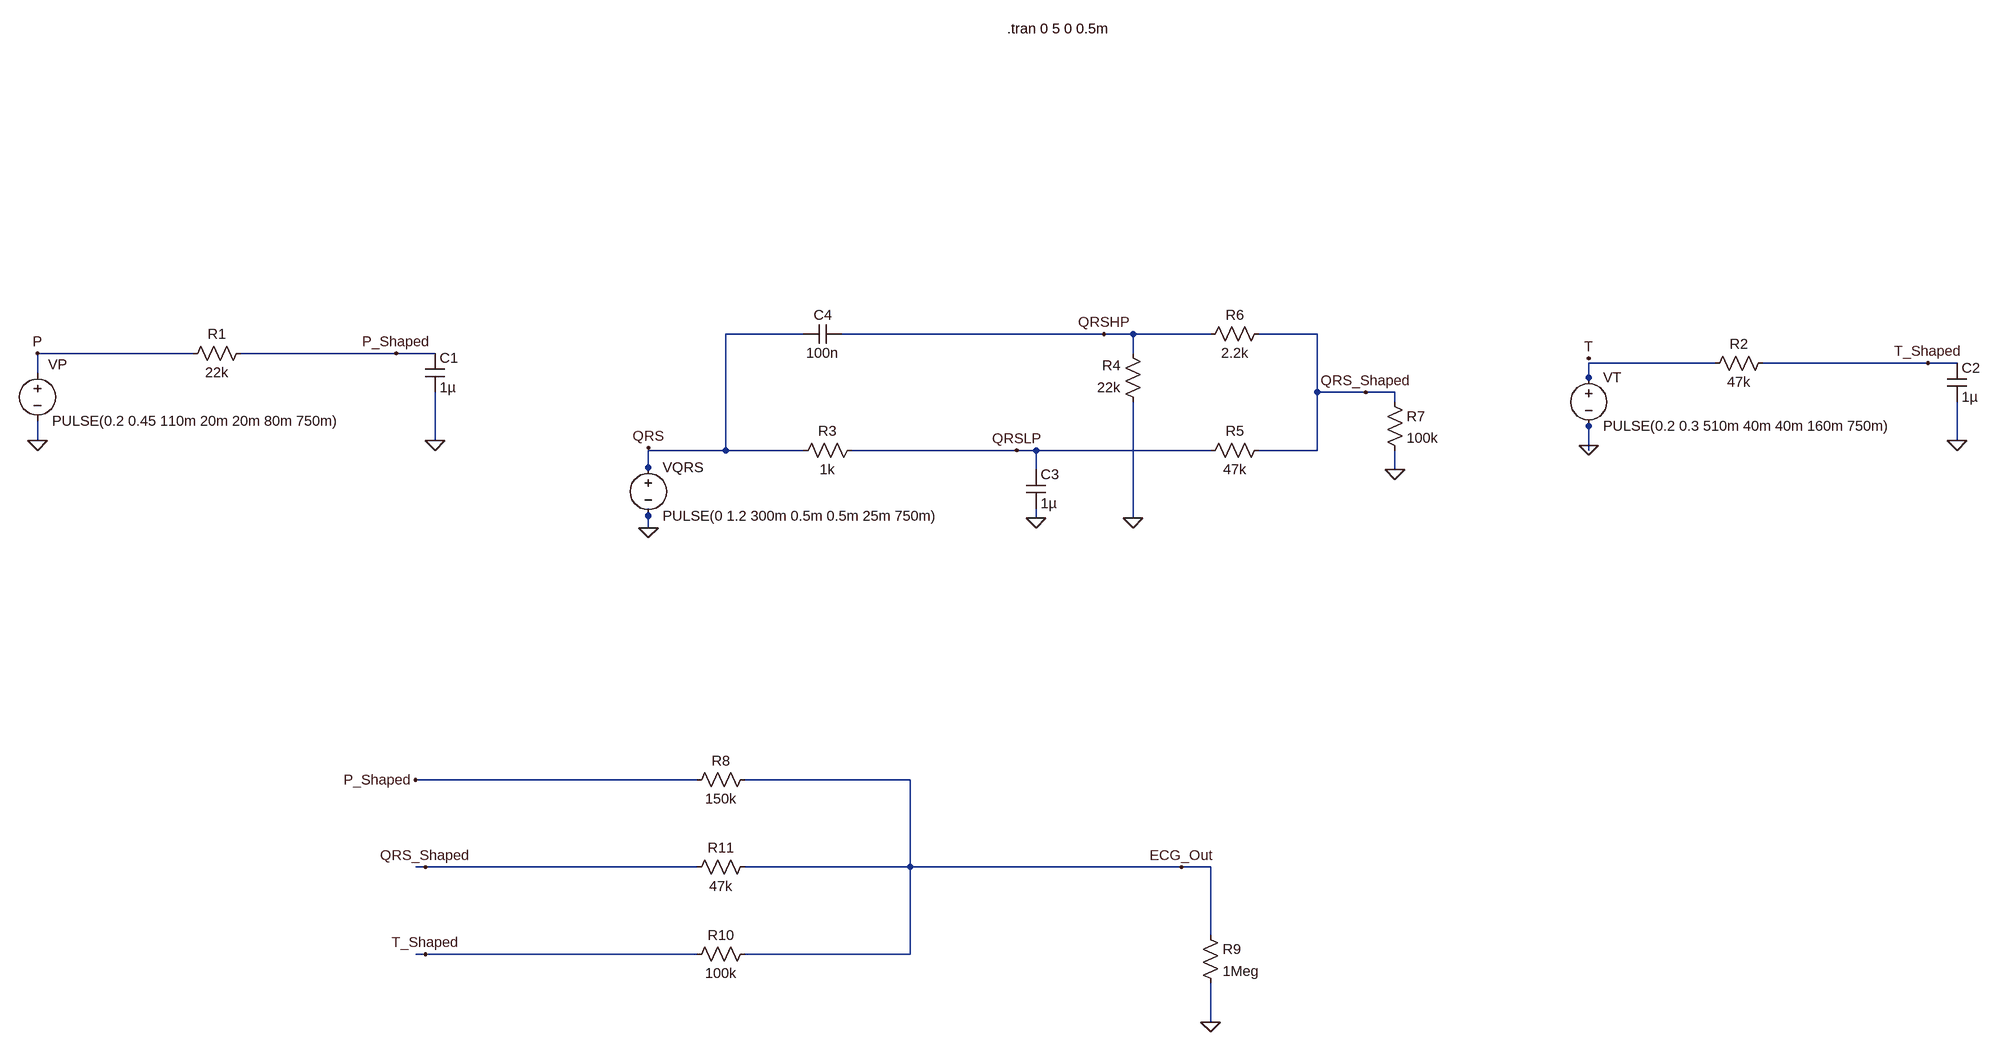
[diagram p0: schematic heartbeat.asc]
heartbeat.asc, the LTspice schematic file:
Version 4.1
SHEET 1 3464 788
WIRE 1376 -368 1248 -368
WIRE 1872 -368 1440 -368
WIRE 1920 -368 1872 -368
WIRE 2048 -368 1920 -368
WIRE 2224 -368 2128 -368
WIRE 368 -336 112 -336
WIRE 704 -336 448 -336
WIRE 768 -336 704 -336
WIRE 1920 -336 1920 -368
WIRE 2880 -320 2672 -320
WIRE 3232 -320 2960 -320
WIRE 3280 -320 3232 -320
WIRE 112 -304 112 -336
WIRE 2672 -296 2672 -320
WIRE 2672 -288 2672 -296
WIRE 2224 -272 2224 -368
WIRE 2304 -272 2224 -272
WIRE 2352 -272 2304 -272
WIRE 2352 -256 2352 -272
WIRE 2672 -216 2672 -224
WIRE 112 -192 112 -224
WIRE 768 -192 768 -272
WIRE 3280 -192 3280 -256
WIRE 2672 -184 2672 -216
WIRE 1248 -176 1248 -368
WIRE 1248 -176 1120 -176
WIRE 1376 -176 1248 -176
WIRE 1728 -176 1456 -176
WIRE 1760 -176 1728 -176
WIRE 2048 -176 1760 -176
WIRE 2224 -176 2224 -272
WIRE 2224 -176 2128 -176
WIRE 2672 -176 2672 -184
WIRE 1120 -148 1120 -176
WIRE 1120 -144 1120 -148
WIRE 1760 -144 1760 -176
WIRE 2352 -144 2352 -176
WIRE 1120 -68 1120 -80
WIRE 1760 -64 1760 -80
WIRE 1920 -64 1920 -256
WIRE 1120 -48 1120 -68
WIRE 1200 368 736 368
WIRE 1552 368 1280 368
WIRE 752 512 736 512
WIRE 1200 512 752 512
WIRE 1552 512 1552 368
WIRE 1552 512 1280 512
WIRE 2000 512 1552 512
WIRE 2048 512 2000 512
WIRE 2048 624 2048 512
WIRE 752 656 736 656
WIRE 1200 656 752 656
WIRE 1552 656 1552 512
WIRE 1552 656 1280 656
WIRE 2048 768 2048 704
FLAG 112 -336 P
FLAG 112 -192 0
FLAG 1120 -180 QRS
FLAG 2672 -328 T
FLAG 2672 -184 0
FLAG 1120 -48 0
FLAG 768 -192 0
FLAG 3280 -192 0
FLAG 1760 -64 0
FLAG 1920 -64 0
FLAG 1872 -368 QRSHP
FLAG 1728 -176 QRSLP
FLAG 2304 -272 QRS_Shaped
FLAG 2352 -144 0
FLAG 704 -336 P_Shaped
FLAG 3232 -320 T_Shaped
FLAG 736 368 P_Shaped
FLAG 752 512 QRS_Shaped
FLAG 752 656 T_Shaped
FLAG 2048 768 0
FLAG 2000 512 ECG_Out
SYMBOL voltage 112 -320 R0
WINDOW 0 18 2 Left 2
WINDOW 123 0 0 Left 0
WINDOW 39 0 0 Left 0
SYMATTR InstName VP
SYMATTR Value PULSE(0.2 0.45 110m 20m 20m 80m 750m)
SYMBOL voltage 1120 -164 R0
WINDOW 123 0 0 Left 0
WINDOW 39 0 0 Left 0
SYMATTR InstName VQRS
SYMATTR Value PULSE(0 1.2 300m 0.5m 0.5m 25m 750m)
SYMBOL voltage 2672 -312 R0
WINDOW 123 0 0 Left 0
WINDOW 39 0 0 Left 0
SYMATTR InstName VT
SYMATTR Value PULSE(0.2 0.3 510m 40m 40m 160m 750m)
SYMBOL res 464 -352 R90
WINDOW 0 0 56 VBottom 2
WINDOW 3 32 56 VTop 2
SYMATTR InstName R1
SYMATTR Value 22k
SYMBOL cap 752 -336 R0
SYMATTR InstName C1
SYMATTR Value 1µ
SYMBOL res 2976 -336 R90
WINDOW 0 0 56 VBottom 2
WINDOW 3 32 56 VTop 2
SYMATTR InstName R2
SYMATTR Value 47k
SYMBOL cap 3264 -320 R0
SYMATTR InstName C2
SYMATTR Value 1µ
SYMBOL res 1472 -192 R90
WINDOW 0 0 56 VBottom 2
WINDOW 3 32 56 VTop 2
SYMATTR InstName R3
SYMATTR Value 1k
SYMBOL cap 1744 -144 R0
SYMATTR InstName C3
SYMATTR Value 1µ
SYMBOL cap 1440 -384 R90
WINDOW 0 0 32 VBottom 2
WINDOW 3 32 32 VTop 2
SYMATTR InstName C4
SYMATTR Value 100n
SYMBOL res 1936 -240 R180
WINDOW 0 36 76 Left 2
WINDOW 3 36 40 Left 2
SYMATTR InstName R4
SYMATTR Value 22k
SYMBOL res 2144 -192 R90
WINDOW 0 0 56 VBottom 2
WINDOW 3 32 56 VTop 2
SYMATTR InstName R5
SYMATTR Value 47k
SYMBOL res 2144 -384 R90
WINDOW 0 0 56 VBottom 2
WINDOW 3 32 56 VTop 2
SYMATTR InstName R6
SYMATTR Value 2.2k
SYMBOL res 2336 -272 R0
SYMATTR InstName R7
SYMATTR Value 100k
SYMBOL res 1296 352 R90
WINDOW 0 0 56 VBottom 2
WINDOW 3 32 56 VTop 2
SYMATTR InstName R8
SYMATTR Value 150k
SYMBOL res 1296 640 R90
WINDOW 0 0 56 VBottom 2
WINDOW 3 32 56 VTop 2
SYMATTR InstName R10
SYMATTR Value 100k
SYMBOL res 2032 608 R0
SYMATTR InstName R9
SYMATTR Value 1Meg
SYMBOL res 1296 496 R90
WINDOW 0 0 56 VBottom 2
WINDOW 3 32 56 VTop 2
SYMATTR InstName R11
SYMATTR Value 47k
TEXT 1712 -872 Left 2 !.tran 0 5 0 0.5m

The netlist it stands for:
* heartbeat.asc
VP P 0 PULSE(0.2 0.45 110m 20m 20m 80m 750m)
VQRS N001 0 PULSE(0 1.2 300m 0.5m 0.5m 25m 750m)
VT N002 0 PULSE(0.2 0.3 510m 40m 40m 160m 750m)
R1 P_Shaped P 22k
C1 P_Shaped 0 1µ
R2 T_Shaped N002 47k
C2 T_Shaped 0 1µ
R3 QRSLP N001 1k
C3 QRSLP 0 1µ
C4 QRSHP N001 100n
R4 0 QRSHP 22k
R5 QRS_Shaped QRSLP 47k
R6 QRS_Shaped QRSHP 2.2k
R7 QRS_Shaped 0 100k
R8 ECG_Out P_Shaped 150k
R10 ECG_Out T_Shaped 100k
R9 ECG_Out 0 1Meg
R11 ECG_Out QRS_Shaped 47k
.tran 0 5 0 0.5m
.backanno
.end